# Altium schematic sheet Schema.schdoc
size 251 x 105 mm
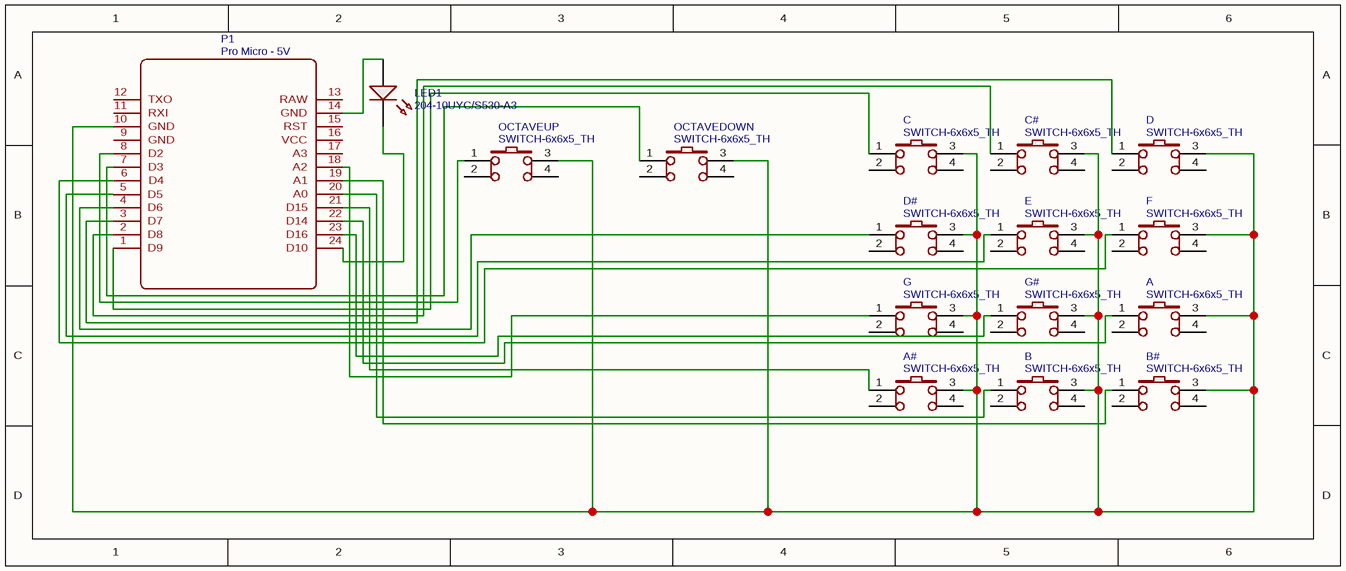
[diagram p0: Schema.schdoc]

## Parts
A  SWITCH-6x6x5_TH  [SWITCH-6X6X5_TH]
A#  SWITCH-6x6x5_TH  [SWITCH-6X6X5_TH]
B  SWITCH-6x6x5_TH  [SWITCH-6X6X5_TH]
B#  SWITCH-6x6x5_TH  [SWITCH-6X6X5_TH]
C  SWITCH-6x6x5_TH  [SWITCH-6X6X5_TH]
C#  SWITCH-6x6x5_TH  [SWITCH-6X6X5_TH]
D  SWITCH-6x6x5_TH  [SWITCH-6X6X5_TH]
D#  SWITCH-6x6x5_TH  [SWITCH-6X6X5_TH]
E  SWITCH-6x6x5_TH  [SWITCH-6X6X5_TH]
F  SWITCH-6x6x5_TH  [SWITCH-6X6X5_TH]
G  SWITCH-6x6x5_TH  [SWITCH-6X6X5_TH]
G#  SWITCH-6x6x5_TH  [SWITCH-6X6X5_TH]
LED1  204-10UYC/S530-A3  [LED-3MM/2.54]
OCTAVEDOWN  SWITCH-6x6x5_TH  [SWITCH-6X6X5_TH]
OCTAVEUP  SWITCH-6x6x5_TH  [SWITCH-6X6X5_TH]
P1  Pro Micro - 5V  [Pro Micro - 5V]

## Nets
NetA#_1: A#.1 P1.21(D15)
NetA_1: A.1 P1.22(D14)
NetA_3: A.3 A#.3 B.3 B#.3 C.3 C#.3 D.3 D#.3 E.3 F.3 G.3 G#.3 OCTAVEDOWN.3 OCTAVEUP.3 P1.10(GND)
NetB#_1: B#.1 P1.19(A1)
NetB_1: B.1 P1.20(A0)
NetC#_1: C#.1 P1.2(D8)
NetC_1: C.1 P1.1(D9)
NetD#_1: D#.1 P1.4(D6)
NetD_1: D.1 P1.3(D7)
NetE_1: E.1 P1.5(D5)
NetF_1: F.1 P1.6(D4)
NetG#_1: G#.1 P1.23(D16)
NetG_1: G.1 P1.18(A2)
NetLED1_1: LED1.1(A) P1.14(GND)
NetLED1_2: LED1.2(C) P1.24(D10)
NetOCTAVEDOWN_1: OCTAVEDOWN.1 P1.7(D3)
NetOCTAVEUP_1: OCTAVEUP.1 P1.8(D2)

Not connected (* = marked no-connect by the designer): A 2 4; A# 2 4; B 2 4; B# 2 4; C 2 4; C# 2 4; D 2 4; D# 2 4; E 2 4; F 2 4; G 2 4; G# 2 4; OCTAVEDOWN 2 4; OCTAVEUP 2 4; P1 9(GND) 11(RXI) 12(TXO) 13(RAW) 15(RST) 16(VCC) 17(A3)

## Library data of the parts
A A# B B# C C# D D# E F G G# OCTAVEDOWN OCTAVEUP = (no symbol name): BOM_Manufacturer: LCSC; BOM_LCSC: C69330; BOM_Supplier: LCSC; BOM_Manufacturer Part: SWITCH-6x6x5_TH; spicePre: S
LED1 = (no symbol name): BOM_Manufacturer: EVERLIGHT; BOM_LCSC: C73643; BOM_Supplier: LCSC; BOM_Manufacturer Part: 204-10UYC/S530-A3; spicePre: L
P1 = (no symbol name): catid: 20; sourceId: 1T5FDZYC8; timeStamp: 1460375612; BOM_Manufacturer Part: ?; spicePre: P